# Altium schematic sheet Digital Audio Amp.SchDoc
size A4; Organization: Altium Limited; Address1: L3, 12a Rodborough Rd; Address2: Frenchs Forest; Address3: NSW; Address4: Australia 2086
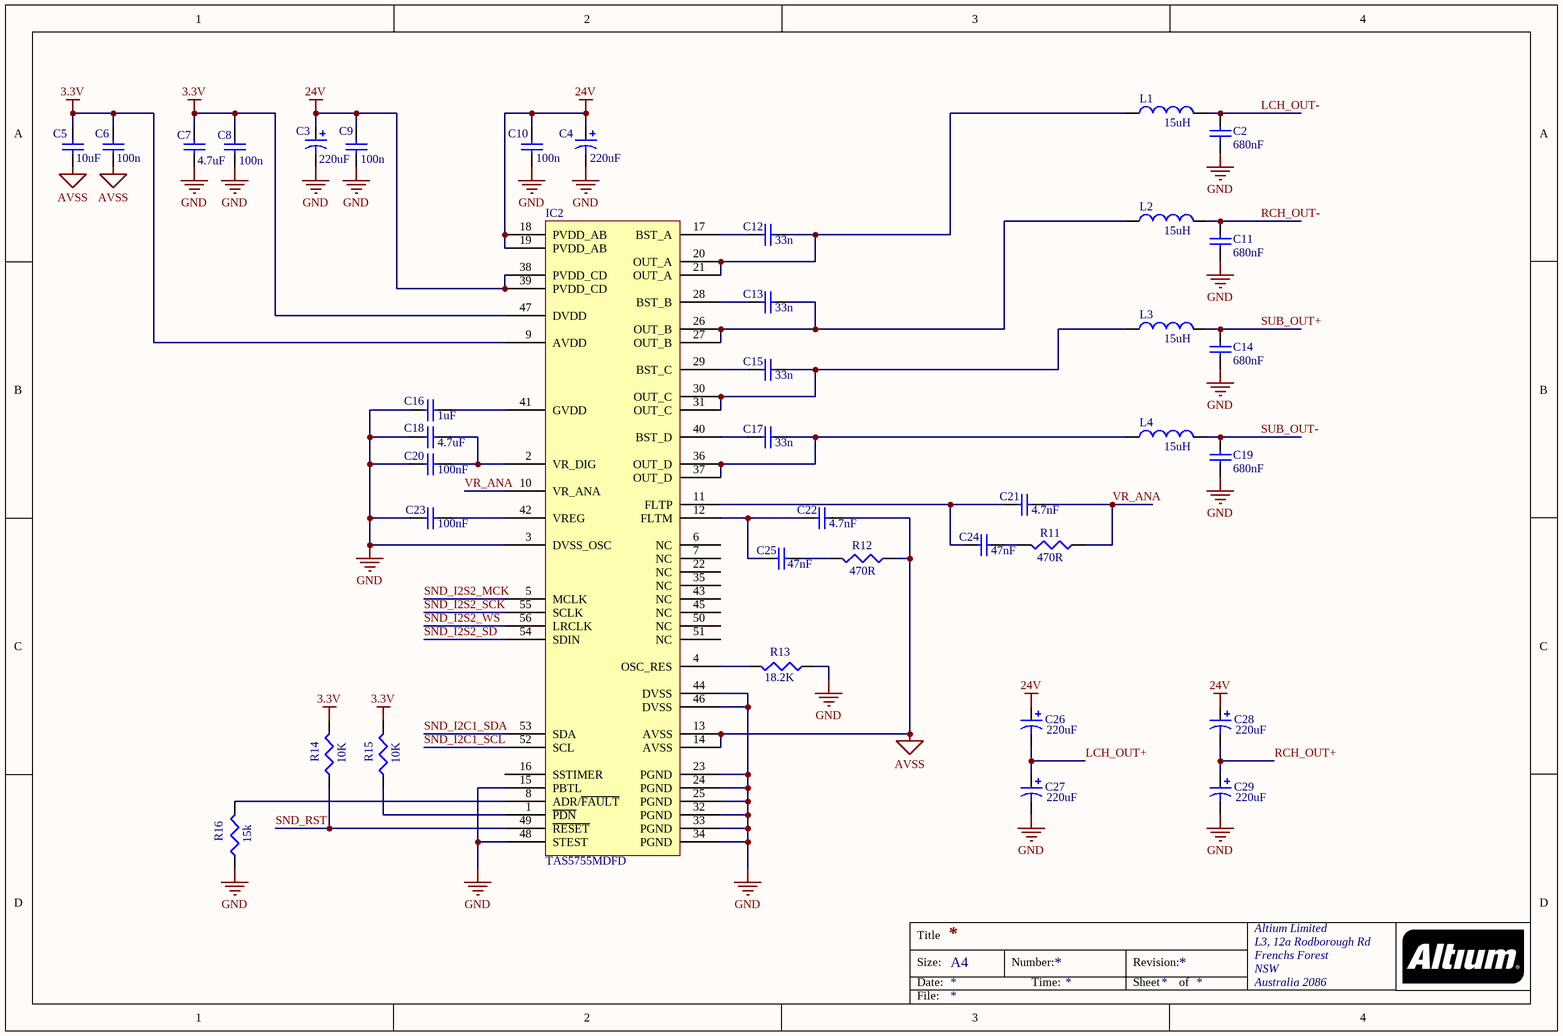
[diagram p0: Digital Audio Amp.SchDoc]

## Parts
C2  value 680nF  [1206C-GENERIC]  (hidden comment: Cap Semi)
C3  value 220uF  [PANACAP-F-GENERIC]  (hidden comment: Cap Pol3)
C4  value 220uF  [PANACAP-F-GENERIC]  (hidden comment: Cap Pol3)
C5  value 10uF  [0805C-GENERIC]  (hidden comment: Cap Semi)
C6  value 100n  [0805C-GENERIC]  (hidden comment: Cap Semi)
C7  value 4.7uF  [0805C-GENERIC]  (hidden comment: Cap Semi)
C8  value 100n  [0805C-GENERIC]  (hidden comment: Cap Semi)
C9  value 100n  [0805C-GENERIC]  (hidden comment: Cap Semi)
C10  value 100n  [0805C-GENERIC]  (hidden comment: Cap Semi)
C11  value 680nF  [1206C-GENERIC]  (hidden comment: Cap Semi)
C12  value 33n  [1206C-GENERIC]  (hidden comment: Cap Semi)
C13  value 33n  [1206C-GENERIC]  (hidden comment: Cap Semi)
C14  value 680nF  [1206C-GENERIC]  (hidden comment: Cap Semi)
C15  value 33n  [1206C-GENERIC]  (hidden comment: Cap Semi)
C16  value 1uF  [0805C-GENERIC]  (hidden comment: Cap Semi)
C17  value 33n  [1206C-GENERIC]  (hidden comment: Cap Semi)
C18  value 4.7uF  [0805C-GENERIC]  (hidden comment: Cap Semi)
C19  value 680nF  [1206C-GENERIC]  (hidden comment: Cap Semi)
C20  value 100nF  [0805C-GENERIC]  (hidden comment: Cap Semi)
C21  value 4.7nF  [0805C-GENERIC]  (hidden comment: Cap Semi)
C22  value 4.7nF  [0805C-GENERIC]  (hidden comment: Cap Semi)
C23  value 100nF  [0805C-GENERIC]  (hidden comment: Cap Semi)
C24  value 47nF  [0805C-GENERIC]  (hidden comment: Cap Semi)
C25  value 47nF  [0805C-GENERIC]  (hidden comment: Cap Semi)
C26  value 220uF  [PANACAP-F-GENERIC]  (hidden comment: Cap Pol3)
C27  value 220uF  [PANACAP-F-GENERIC]  (hidden comment: Cap Pol3)
C28  value 220uF  [PANACAP-F-GENERIC]  (hidden comment: Cap Pol3)
C29  value 220uF  [PANACAP-F-GENERIC]  (hidden comment: Cap Pol3)
IC2  TAS5755MDFD  [DFD (R-PDSO-G56)]
L1  value 15uH  [7447709150]  (hidden comment: Inductor)
L2  value 15uH  [7447709150]  (hidden comment: Inductor)
L3  value 15uH  [7447709150]  (hidden comment: Inductor)
L4  value 15uH  [7447709150]  (hidden comment: Inductor)
R11  value 470R  [0805R-GENERIC]  (hidden comment: Res3)
R12  value 470R  [0805R-GENERIC]  (hidden comment: Res3)
R13  value 18.2K  [0805R-GENERIC]  (hidden comment: Res3)
R14  value 10K  [0805R-GENERIC]  (hidden comment: Res3)
R15  value 10K  [0805R-GENERIC]  (hidden comment: Res3)
R16  value 15k  [0805R-GENERIC]  (hidden comment: Res3)

## Nets
3.3V: C5.1 C6.2 C7.2 C8.2 IC2.9(AVDD) IC2.47(DVDD) R14.2 R15.2
24V: C3.1 C4.1 C9.2 C10.2 C26.1 C28.1 IC2.18(PVDD_AB) IC2.19(PVDD_AB) IC2.38(PVDD_CD) IC2.39(PVDD_CD)
AVSS: C5.2 C6.1 C22.1 IC2.13(AVSS) IC2.14(AVSS) R12.1
GND: C2.2 C3.2 C4.2 C7.1 C8.1 C9.1 C10.1 C11.2 C14.2 C16.2 C18.2 C19.2 C20.2 C23.2 C27.2 C29.2 IC2.3(DVSS_OSC) IC2.15(PBTL) IC2.23(PGND) IC2.24(PGND) IC2.25(PGND) IC2.32(PGND) IC2.33(PGND) IC2.34(PGND) IC2.44(DVSS) IC2.46(DVSS) IC2.48(STEST) R13.1 R16.1
LCH_OUT+: C26.2 C27.1
LCH_OUT-: C2.1 L1.2
RCH_OUT+: C28.2 C29.1
RCH_OUT-: C11.1 L2.2
SND_I2C1_SCL: IC2.52(SCL)
SND_I2C1_SDA: IC2.53(SDA)
SND_I2S2_MCK: IC2.5(MCLK)
SND_I2S2_SCK: IC2.55(SCLK)
SND_I2S2_SD: IC2.54(SDIN)
SND_I2S2_WS: IC2.56(LRCLK)
SND_RST: IC2.49(~{RESET}) R14.1
SUB_OUT+: C14.1 L3.2
SUB_OUT-: C19.1 L4.2
VR_ANA: C21.1 IC2.10(VR_ANA) R11.1
NetC12_1: C12.1 IC2.20(OUT_A) IC2.21(OUT_A) L1.1
NetC12_2: C12.2 IC2.17(BST_A)
NetC13_1: C13.1 IC2.26(OUT_B) IC2.27(OUT_B) L2.1
NetC13_2: C13.2 IC2.28(BST_B)
NetC15_1: C15.1 IC2.30(OUT_C) IC2.31(OUT_C) L3.1
NetC15_2: C15.2 IC2.29(BST_C)
NetC16_1: C16.1 IC2.41(GVDD)
NetC17_1: C17.1 IC2.36(OUT_D) IC2.37(OUT_D) L4.1
NetC17_2: C17.2 IC2.40(BST_D)
NetC18_1: C18.1 C20.1 IC2.2(VR_DIG)
NetC21_2: C21.2 C24.2 IC2.11(FLTP)
NetC22_2: C22.2 C25.2 IC2.12(FLTM)
NetC23_1: C23.1 IC2.42(VREG)
NetC24_1: C24.1 R11.2
NetC25_1: C25.1 R12.2
NetIC2_1: IC2.1(~{PDN}) R15.1
NetIC2_4: IC2.4(OSC_RES) R13.2
NetIC2_8: IC2.8(ADR/~{FAULT}) R16.2

Not connected (* = marked no-connect by the designer): IC2 6(NC) 7(NC) 16(SSTIMER) 22(NC) 35(NC) 43(NC) 45(NC) 50(NC) 51(NC)

## Notes on the sheet
- Title
- Size:
- Date:
- A4
- Number:
- Time:
- Revision:
- Sheet
- of
- File:

## Library data of the parts
C2 C5-C25 = Cap Semi: Capacitor (Semiconductor SIM Model); Published: 8-Jun-2000; LatestRevisionDate: 29-May-2009; LatestRevisionNote: IPC-7351 Footprint Added.; PackageReference: C1206; Publisher: Altium Limited; PackageDescription: Chip Capacitor
C3 C4 C26-C29 = Cap Pol3: Polarized Capacitor (Surface Mount); pin to pad: 1>+ 2>-; Published: 8-Jun-2000; LatestRevisionDate: 29-May-2009; LatestRevisionNote: IPC-7351 Footprint Added.; PackageReference: C0805; Publisher: Altium Limited; PackageDescription: Chip Capacitor
IC2 = TAS5755MDFD: 2x50W(2x19W + 1x50W) Digital Input Class-D Audio Amplifier with Processing and 2.1 Mode Support
L1-L4 = Inductor: Code_IEC: 1005; Published: 8-Jun-2000; LatestRevisionDate: 29-May-2009; LatestRevisionNote: IPC-7351 Footprint Added.; PackageReference: 0402-A; Publisher: Altium Limited; PackageDescription: Chip Inductor; Code_JEITA: 0402
R11-R16 = Res3: Resistor; Published: 8-Jun-2000; LatestRevisionDate: 29-May-2009; LatestRevisionNote: IPC-7351 Footprint Added.; PackageReference: J1-0603; Publisher: Altium Limited; PackageDescription: Chip Resistor